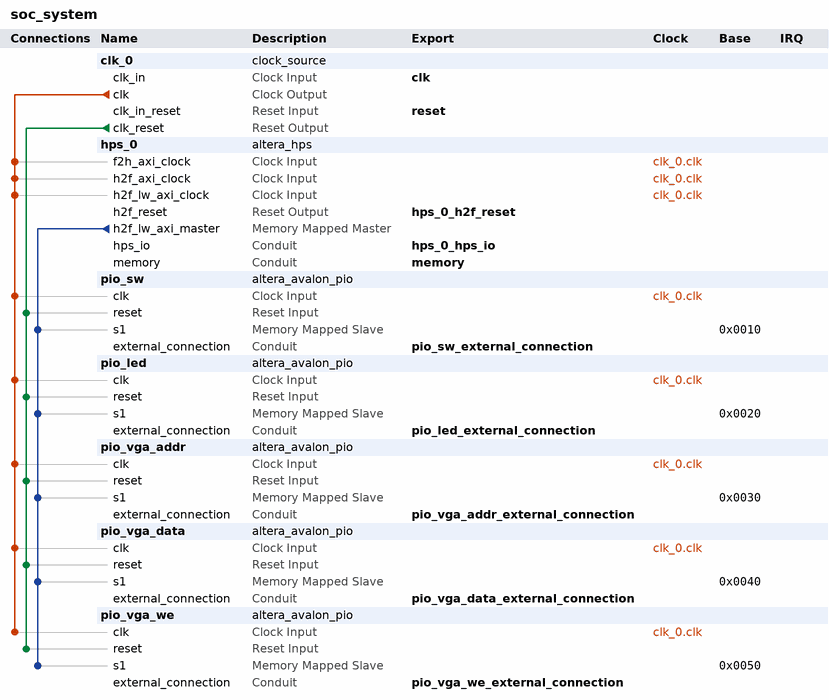
[diagram p0: system contents]
# Platform Designer (Qsys) system soc_system, Cyclone V 5CSEMA5F31C6
# Parameters at their usual value, and those the tool derives, are not listed.
package require -exact qsys 14.1
create_system soc_system
set_project_property DEVICE_FAMILY {Cyclone V}
set_project_property DEVICE 5CSEMA5F31C6

add_instance clk_0 clock_source 14.1
set_instance_parameter_value clk_0 clockFrequency 100000000

add_instance hps_0 altera_hps 14.1
set_instance_parameter_value hps_0 EMAC1_Mode RGMII
set_instance_parameter_value hps_0 EMAC1_PinMuxing {HPS I/O Set 0}
set_instance_parameter_value hps_0 F2SCLK_COLDRST_Enable false
set_instance_parameter_value hps_0 F2SCLK_DBGRST_Enable false
set_instance_parameter_value hps_0 F2SCLK_WARMRST_Enable false
set_instance_parameter_value hps_0 F2SINTERRUPT_Enable true
set_instance_parameter_value hps_0 F2S_Width 2
set_instance_parameter_value hps_0 FPGA_PERIPHERAL_OUTPUT_CLOCK_FREQ_EMAC0_GTX_CLK 100
set_instance_parameter_value hps_0 FPGA_PERIPHERAL_OUTPUT_CLOCK_FREQ_EMAC0_MD_CLK 100
set_instance_parameter_value hps_0 FPGA_PERIPHERAL_OUTPUT_CLOCK_FREQ_EMAC1_GTX_CLK 100
set_instance_parameter_value hps_0 FPGA_PERIPHERAL_OUTPUT_CLOCK_FREQ_EMAC1_MD_CLK 100
set_instance_parameter_value hps_0 HPS_PROTOCOL DDR3
set_instance_parameter_value hps_0 I2C0_Mode I2C
set_instance_parameter_value hps_0 I2C0_PinMuxing {HPS I/O Set 0}
set_instance_parameter_value hps_0 I2C1_Mode I2C
set_instance_parameter_value hps_0 I2C1_PinMuxing {HPS I/O Set 0}
set_instance_parameter_value hps_0 LWH2F_Enable true
set_instance_parameter_value hps_0 MEM_BANKADDR_WIDTH 3
set_instance_parameter_value hps_0 MEM_CLK_FREQ 400.0
set_instance_parameter_value hps_0 MEM_COL_ADDR_WIDTH 10
set_instance_parameter_value hps_0 MEM_DQ_WIDTH 32
set_instance_parameter_value hps_0 MEM_DRV_STR RZQ/7
set_instance_parameter_value hps_0 MEM_ROW_ADDR_WIDTH 15
set_instance_parameter_value hps_0 MEM_RTT_NOM RZQ/4
set_instance_parameter_value hps_0 MEM_RTT_WR RZQ/4
set_instance_parameter_value hps_0 MEM_TCL 11
set_instance_parameter_value hps_0 MEM_TFAW_NS 30.0
set_instance_parameter_value hps_0 MEM_TRAS_NS 35.0
set_instance_parameter_value hps_0 MEM_TRCD_NS 13.75
set_instance_parameter_value hps_0 MEM_TRFC_NS 260.0
set_instance_parameter_value hps_0 MEM_TRP_NS 13.75
set_instance_parameter_value hps_0 MEM_VENDOR JEDEC
set_instance_parameter_value hps_0 MEM_WTCL 8
set_instance_parameter_value hps_0 QSPI_Mode {1 SS}
set_instance_parameter_value hps_0 QSPI_PinMuxing {HPS I/O Set 0}
set_instance_parameter_value hps_0 REF_CLK_FREQ 25.0
set_instance_parameter_value hps_0 S2F_Width 2
set_instance_parameter_value hps_0 SDIO_Mode {4-bit Data}
set_instance_parameter_value hps_0 SDIO_PinMuxing {HPS I/O Set 0}
set_instance_parameter_value hps_0 SPIM1_Mode {Single Slave Select}
set_instance_parameter_value hps_0 SPIM1_PinMuxing {HPS I/O Set 0}
set_instance_parameter_value hps_0 STM_Enable false
set_instance_parameter_value hps_0 TIMING_BOARD_AC_SKEW 0.03
set_instance_parameter_value hps_0 TIMING_BOARD_AC_TO_CK_SKEW 0.0
set_instance_parameter_value hps_0 TIMING_BOARD_DQ_TO_DQS_SKEW 0.0
set_instance_parameter_value hps_0 TIMING_BOARD_MAX_CK_DELAY 0.03
set_instance_parameter_value hps_0 TIMING_BOARD_MAX_DQS_DELAY 0.02
set_instance_parameter_value hps_0 TIMING_BOARD_SKEW_BETWEEN_DQS 0.08
set_instance_parameter_value hps_0 TIMING_BOARD_SKEW_CKDQS_DIMM_MAX 0.16
set_instance_parameter_value hps_0 TIMING_BOARD_SKEW_CKDQS_DIMM_MIN 0.09
set_instance_parameter_value hps_0 TIMING_BOARD_SKEW_WITHIN_DQS 0.01
set_instance_parameter_value hps_0 TIMING_TDH 65
set_instance_parameter_value hps_0 TIMING_TDQSCK 255
set_instance_parameter_value hps_0 TIMING_TDQSQ 125
set_instance_parameter_value hps_0 TIMING_TDS 30
set_instance_parameter_value hps_0 TIMING_TIH 140
set_instance_parameter_value hps_0 TIMING_TIS 180
set_instance_parameter_value hps_0 TIMING_TQSH 0.4
set_instance_parameter_value hps_0 UART0_Mode {No Flow Control}
set_instance_parameter_value hps_0 UART0_PinMuxing {HPS I/O Set 0}
set_instance_parameter_value hps_0 USB1_Mode SDR
set_instance_parameter_value hps_0 USB1_PinMuxing {HPS I/O Set 0}
set_instance_parameter_value hps_0 desired_cfg_clk_mhz 100.0
set_instance_parameter_value hps_0 desired_qspi_clk_mhz 400.0

add_instance pio_sw altera_avalon_pio 14.1
set_instance_parameter_value pio_sw direction Input
set_instance_parameter_value pio_sw width 10

add_instance pio_led altera_avalon_pio 14.1
set_instance_parameter_value pio_led direction Output
set_instance_parameter_value pio_led resetValue 1023
set_instance_parameter_value pio_led width 10

add_instance pio_vga_addr altera_avalon_pio 14.1
set_instance_parameter_value pio_vga_addr direction Output
set_instance_parameter_value pio_vga_addr width 19

add_instance pio_vga_data altera_avalon_pio 14.1
set_instance_parameter_value pio_vga_data direction Output
set_instance_parameter_value pio_vga_data width 8

add_instance pio_vga_we altera_avalon_pio 14.1
set_instance_parameter_value pio_vga_we direction Output
set_instance_parameter_value pio_vga_we width 1

# connections
add_connection clk_0.clk hps_0.f2h_axi_clock clock
add_connection clk_0.clk hps_0.h2f_axi_clock clock
add_connection clk_0.clk hps_0.h2f_lw_axi_clock clock
add_connection clk_0.clk pio_led.clk clock
add_connection clk_0.clk pio_sw.clk clock
add_connection clk_0.clk pio_vga_addr.clk clock
add_connection clk_0.clk pio_vga_data.clk clock
add_connection clk_0.clk pio_vga_we.clk clock
add_connection clk_0.clk_reset pio_led.reset reset
add_connection clk_0.clk_reset pio_sw.reset reset
add_connection clk_0.clk_reset pio_vga_addr.reset reset
add_connection clk_0.clk_reset pio_vga_data.reset reset
add_connection clk_0.clk_reset pio_vga_we.reset reset
add_connection hps_0.h2f_lw_axi_master pio_led.s1 avalon
set_connection_parameter_value hps_0.h2f_lw_axi_master/pio_led.s1 baseAddress 0x0020
add_connection hps_0.h2f_lw_axi_master pio_sw.s1 avalon
set_connection_parameter_value hps_0.h2f_lw_axi_master/pio_sw.s1 baseAddress 0x0010
add_connection hps_0.h2f_lw_axi_master pio_vga_addr.s1 avalon
set_connection_parameter_value hps_0.h2f_lw_axi_master/pio_vga_addr.s1 baseAddress 0x0030
add_connection hps_0.h2f_lw_axi_master pio_vga_data.s1 avalon
set_connection_parameter_value hps_0.h2f_lw_axi_master/pio_vga_data.s1 baseAddress 0x0040
add_connection hps_0.h2f_lw_axi_master pio_vga_we.s1 avalon
set_connection_parameter_value hps_0.h2f_lw_axi_master/pio_vga_we.s1 baseAddress 0x0050

# exported interfaces
add_interface clk clock sink
set_interface_property clk EXPORT_OF clk_0.clk_in
add_interface hps_0_h2f_reset reset source
set_interface_property hps_0_h2f_reset EXPORT_OF hps_0.h2f_reset
add_interface hps_0_hps_io conduit end
set_interface_property hps_0_hps_io EXPORT_OF hps_0.hps_io
add_interface memory conduit end
set_interface_property memory EXPORT_OF hps_0.memory
add_interface pio_led_external_connection conduit end
set_interface_property pio_led_external_connection EXPORT_OF pio_led.external_connection
add_interface pio_sw_external_connection conduit end
set_interface_property pio_sw_external_connection EXPORT_OF pio_sw.external_connection
add_interface pio_vga_addr_external_connection conduit end
set_interface_property pio_vga_addr_external_connection EXPORT_OF pio_vga_addr.external_connection
add_interface pio_vga_data_external_connection conduit end
set_interface_property pio_vga_data_external_connection EXPORT_OF pio_vga_data.external_connection
add_interface pio_vga_we_external_connection conduit end
set_interface_property pio_vga_we_external_connection EXPORT_OF pio_vga_we.external_connection
add_interface reset reset sink
set_interface_property reset EXPORT_OF clk_0.clk_in_reset

set_interconnect_requirement {$system} qsys_mm.clockCrossingAdapter HANDSHAKE
set_interconnect_requirement {$system} qsys_mm.maxAdditionalLatency 1

save_system soc_system.qsys
